# Altium schematic sheet ICwT_main.SchDoc
size A4
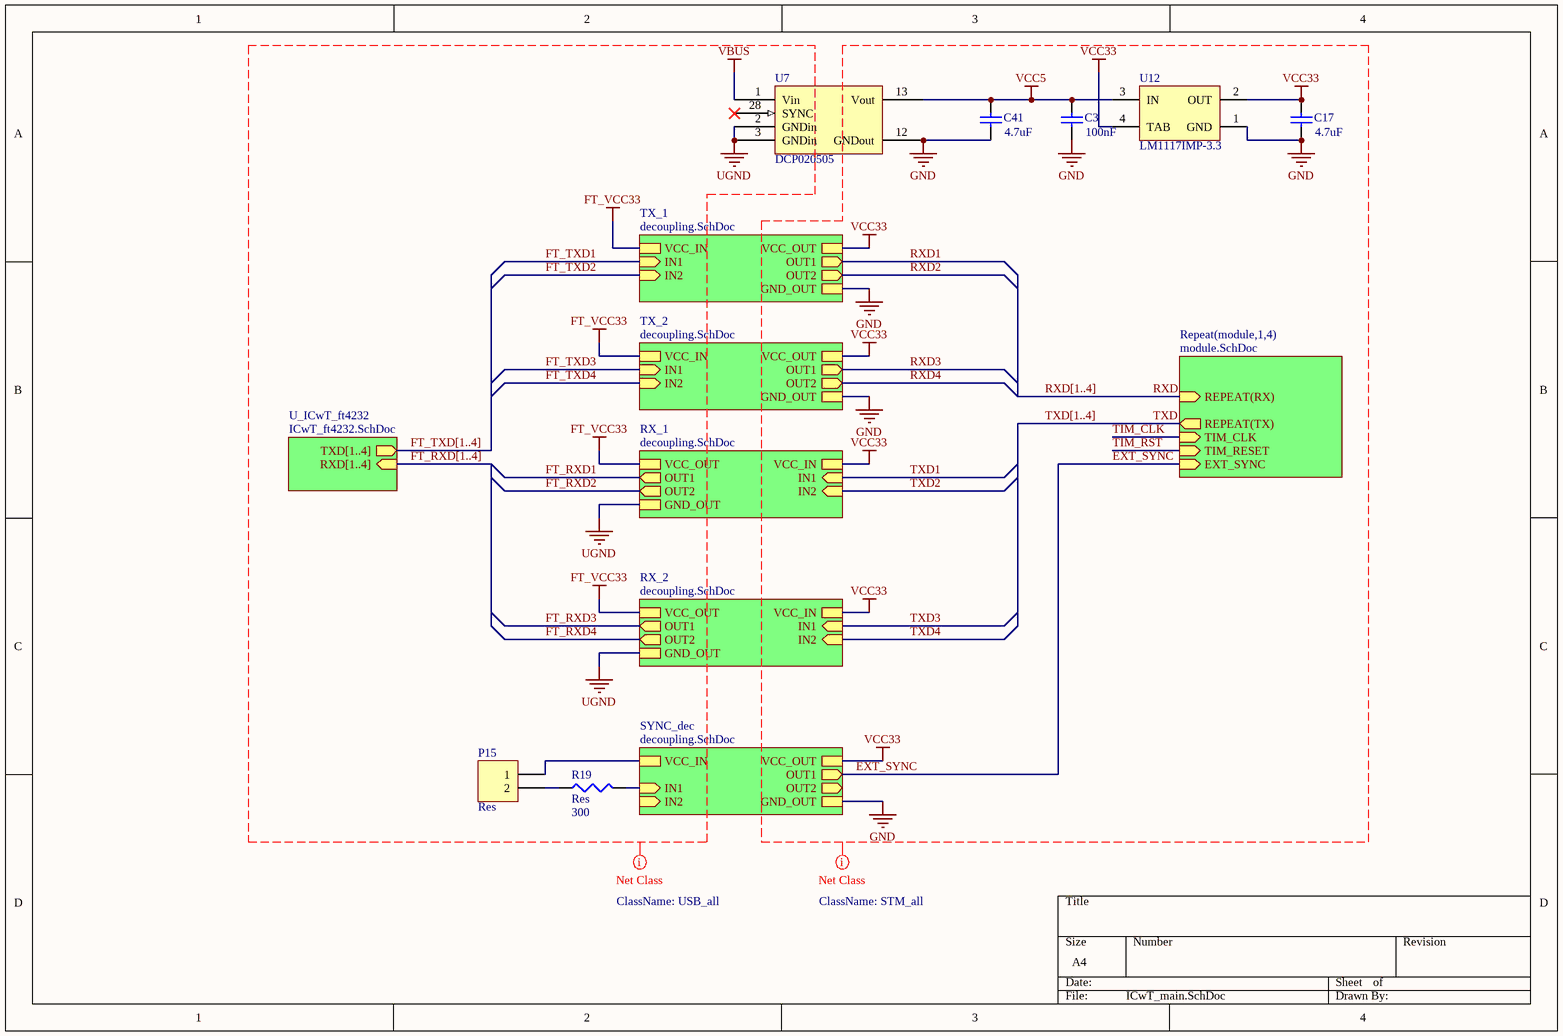
[diagram p0: ICwT_main.SchDoc]

## Parts
C3  value 100nF  [C_0603]  (hidden comment: Cap)
C17  value 4.7uF  [C_0603]  (hidden comment: Cap)
C41  value 4.7uF  [C_0603]  (hidden comment: Cap)
P15  Res  [PAS]
R19  Res  value 300  [R_0603]
U7  DCP020505  [SOP127P1020X280-28M]
U12  LM1117IMP-3.3  [MP04A_L]

## Sub-sheets
Repeat(module,1,4) = module.SchDoc: TIM_CLK (in), TIM_RESET (in), EXT_SYNC (in), REPEAT(RX) (in), REPEAT(TX) (out)
RX_1 = decoupling.SchDoc: VCC_IN, VCC_OUT, GND_OUT, IN1 (in), OUT1 (out), IN2 (in), OUT2 (out)
RX_2 = decoupling.SchDoc: VCC_IN, VCC_OUT, GND_OUT, IN1 (in), OUT1 (out), IN2 (in), OUT2 (out)
SYNC_dec = decoupling.SchDoc: VCC_IN, VCC_OUT, GND_OUT, IN1 (in), OUT1 (out), IN2 (in), OUT2 (out)
TX_1 = decoupling.SchDoc: VCC_IN, VCC_OUT, GND_OUT, IN1 (in), OUT1 (out), IN2 (in), OUT2 (out)
TX_2 = decoupling.SchDoc: VCC_IN, VCC_OUT, GND_OUT, IN1 (in), OUT1 (out), IN2 (in), OUT2 (out)
U_ICwT_ft4232 = ICwT_ft4232.SchDoc: TXD[1..4] (out), RXD[1..4] (in)

## Nets
FT_VCC33: sheet TX_2/VCC_IN, sheet RX_1/VCC_OUT, sheet TX_1/VCC_IN, sheet RX_2/VCC_OUT
GND: C3.1 C17.1 C41.1 U7.12(GNDout) U12.1(GND) ; sheet TX_2/GND_OUT, sheet SYNC_dec/GND_OUT, sheet TX_1/GND_OUT
UGND: U7.2(GNDin) U7.3(GNDin) ; sheet RX_1/GND_OUT, sheet RX_2/GND_OUT
VBUS: U7.1(Vin)
VCC5: C3.2 C41.2 U7.13(Vout) U12.3(IN)
VCC33: C17.2 U12.2(OUT) U12.4(TAB) ; sheet TX_2/VCC_OUT, sheet SYNC_dec/VCC_OUT, sheet RX_1/VCC_IN, sheet TX_1/VCC_OUT, sheet RX_2/VCC_IN
EXT_SYNC: sheet SYNC_dec/OUT1, sheet Repeat(module,1,4)/EXT_SYNC
FT_RXD1: sheet RX_1/OUT1
FT_RXD2: sheet RX_1/OUT2
FT_RXD3: sheet RX_2/OUT1
FT_RXD4: sheet RX_2/OUT2
FT_TXD1: sheet TX_1/IN1
FT_TXD2: sheet TX_1/IN2
FT_TXD3: sheet TX_2/IN1
FT_TXD4: sheet TX_2/IN2
RXD: sheet Repeat(module,1,4)/REPEAT(RX)
RXD1: sheet TX_1/OUT1
RXD2: sheet TX_1/OUT2
RXD3: sheet TX_2/OUT1
RXD4: sheet TX_2/OUT2
TIM_CLK: sheet Repeat(module,1,4)/TIM_CLK
TIM_RST: sheet Repeat(module,1,4)/TIM_RESET
TXD: sheet Repeat(module,1,4)/REPEAT(TX)
TXD1: sheet RX_1/IN1
TXD2: sheet RX_1/IN2
TXD3: sheet RX_2/IN1
TXD4: sheet RX_2/IN2
NetP15_1: P15.1 ; sheet SYNC_dec/VCC_IN
NetP15_2: P15.2 R19.1
NetR19_2: R19.2 ; sheet SYNC_dec/IN1

Not connected (* = marked no-connect by the designer): U7 14(NC) 15(NC) 16(NC) 17(NC) 26(NC) 27(NC) 28(SYNC)*

## Buses and harness runs
bus FT_RXD[1..4] = sheet U_ICwT_ft4232/RXD[1..4]
bus FT_TXD[1..4] = sheet U_ICwT_ft4232/TXD[1..4]
bus RXD[1..4]
bus TXD[1..4]

## Layout directives
net class USB_all: FT_RXD1, FT_RXD2, FT_RXD3, FT_RXD4, FT_RXD[1..4], FT_TXD1, FT_TXD2, FT_TXD3, FT_TXD4, FT_TXD[1..4], FT_VCC33, UGND, VBUS
net class STM_all: EXT_SYNC, GND, RXD, RXD1, RXD2, RXD3, RXD4, RXD[1..4], TIM_CLK, TIM_RST, TXD, TXD1, TXD2, TXD3, TXD4, TXD[1..4], VCC5, VCC33

## Library data of the parts
C3 C17 C41 = Cap: Capacitor; Published: 8-Jun-2000; LatestRevisionDate: 17-Jul-2002; LatestRevisionNote: Re-released for DXP Platform.; PackageReference: RAD-0.3; Publisher: Altium Limited; PackageDescription: Radial Cap, Thru-Hole; 2 Leads; 0.3 in Pin Spacing
P15 = Header 2: Header, 2-Pin, 3.5mm pitch; LatestRevisionDate: 17-Jul-2002; LatestRevisionNote: Re-released for DXP Platform.; Publisher: Altium Limited
R19 = Res3: Resistor; Published: 8-Jun-2000; LatestRevisionDate: 29-May-2009; LatestRevisionNote: IPC-7351 Footprint Added.; PackageReference: J1-0603; Publisher: Altium Limited; PackageDescription: Chip Resistor
U7 = DCP020505: Power galvanic isolation
U12 = LM1117IMP-3.3: 800mA Low-Dropout Linear Regulator; Manufacturer: National Semiconductor; CompType: LDO IC; PackageTopMarking: XYTT*N05B; PowerWise: N; Published: 4-Dec-2008; DatasheetVersion: Apr-2006; PackageVersion: revB, Apr-2003; PackageReference: MP04A; Publisher: Altium Limited; PackageDescription: Molded SOT-223, 6.50 x 3.56 x 1.6mm Body, 4 Lead, 2.3mm Pitch; PartNumber: LM1117IMP-3.3; RoHS: O; PinCount: 4; DigiKeyPartNumber: LM1117IMP-3.3CT-ND; Code_JEDEC: TO-261-AA; Code_IPC: SOT223-4; ComponentLink1Description: LM1117 Datasheet; ComponentLink1URL: http://www.national.com/ds/LM/LM1117.pdf; ComponentLink2Description: LM1117 Web Page; ComponentLink2URL: http://www.national.com/pf/LM/LM1117.html; ComponentLink3Description: MP04A Package Page; ComponentLink3URL: http://www.national.com/packaging/folders/mp04a.html